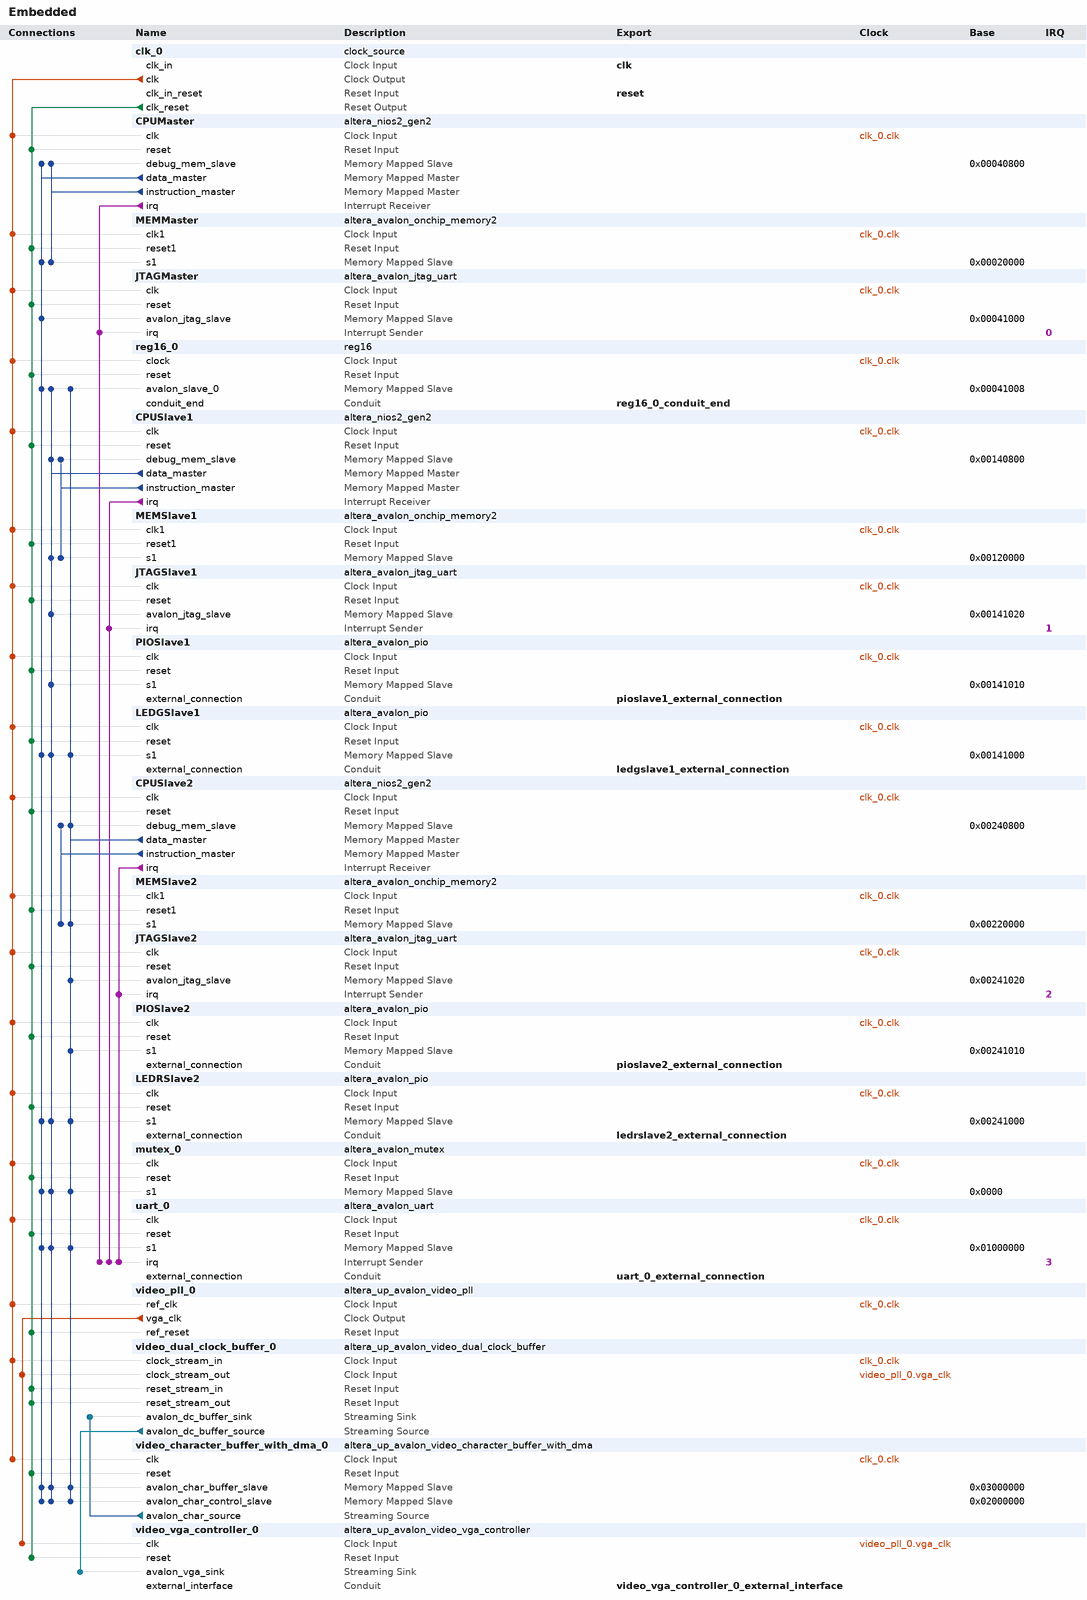
[diagram p0: system contents]
# Platform Designer (Qsys) system Embedded, Cyclone IV E EP4CE115F29C7
# Parameters at their usual value, and those the tool derives, are not listed.
package require -exact qsys 15.0
create_system Embedded
set_project_property DEVICE_FAMILY {Cyclone IV E}
set_project_property DEVICE EP4CE115F29C7

add_instance clk_0 clock_source 15.0
set_instance_parameter_value clk_0 clockFrequency 50000000

add_instance CPUMaster altera_nios2_gen2 15.0
set_instance_parameter_value CPUMaster dcache_size 2048
set_instance_parameter_value CPUMaster exceptionSlave MEMMaster.s1
set_instance_parameter_value CPUMaster icache_size 4096
set_instance_parameter_value CPUMaster impl Fast
set_instance_parameter_value CPUMaster resetSlave MEMMaster.s1

add_instance MEMMaster altera_avalon_onchip_memory2 15.0
set_instance_parameter_value MEMMaster dataWidth 32
set_instance_parameter_value MEMMaster dualPort false
set_instance_parameter_value MEMMaster initMemContent true
set_instance_parameter_value MEMMaster initializationFileName onchip_mem.hex
set_instance_parameter_value MEMMaster memorySize 100000

add_instance JTAGMaster altera_avalon_jtag_uart 15.0
set_instance_parameter_value JTAGMaster simInteractiveOptions NO_INTERACTIVE_WINDOWS

add_instance reg16_0 reg16 1.0

add_instance CPUSlave1 altera_nios2_gen2 15.0
set_instance_parameter_value CPUSlave1 dcache_size 2048
set_instance_parameter_value CPUSlave1 exceptionSlave MEMSlave1.s1
set_instance_parameter_value CPUSlave1 icache_size 4096
set_instance_parameter_value CPUSlave1 impl Fast
set_instance_parameter_value CPUSlave1 resetSlave MEMSlave1.s1

add_instance MEMSlave1 altera_avalon_onchip_memory2 15.0
set_instance_parameter_value MEMSlave1 dataWidth 32
set_instance_parameter_value MEMSlave1 dualPort false
set_instance_parameter_value MEMSlave1 initMemContent true
set_instance_parameter_value MEMSlave1 initializationFileName onchip_mem.hex
set_instance_parameter_value MEMSlave1 memorySize 80000

add_instance JTAGSlave1 altera_avalon_jtag_uart 15.0
set_instance_parameter_value JTAGSlave1 simInteractiveOptions NO_INTERACTIVE_WINDOWS

add_instance PIOSlave1 altera_avalon_pio 15.0
set_instance_parameter_value PIOSlave1 direction Input
set_instance_parameter_value PIOSlave1 width 16

add_instance LEDGSlave1 altera_avalon_pio 15.0
set_instance_parameter_value LEDGSlave1 direction Output
set_instance_parameter_value LEDGSlave1 width 8

add_instance CPUSlave2 altera_nios2_gen2 15.0
set_instance_parameter_value CPUSlave2 dcache_size 2048
set_instance_parameter_value CPUSlave2 exceptionSlave MEMSlave2.s1
set_instance_parameter_value CPUSlave2 icache_size 4096
set_instance_parameter_value CPUSlave2 impl Fast
set_instance_parameter_value CPUSlave2 resetSlave MEMSlave2.s1

add_instance MEMSlave2 altera_avalon_onchip_memory2 15.0
set_instance_parameter_value MEMSlave2 dataWidth 32
set_instance_parameter_value MEMSlave2 dualPort false
set_instance_parameter_value MEMSlave2 initMemContent true
set_instance_parameter_value MEMSlave2 initializationFileName onchip_mem.hex
set_instance_parameter_value MEMSlave2 memorySize 80000

add_instance JTAGSlave2 altera_avalon_jtag_uart 15.0
set_instance_parameter_value JTAGSlave2 simInteractiveOptions NO_INTERACTIVE_WINDOWS

add_instance PIOSlave2 altera_avalon_pio 15.0
set_instance_parameter_value PIOSlave2 direction Input
set_instance_parameter_value PIOSlave2 width 16

add_instance LEDRSlave2 altera_avalon_pio 15.0
set_instance_parameter_value LEDRSlave2 direction Output
set_instance_parameter_value LEDRSlave2 width 8

add_instance mutex_0 altera_avalon_mutex 15.0

add_instance uart_0 altera_avalon_uart 15.0
set_instance_parameter_value uart_0 baud 2400
set_instance_parameter_value uart_0 dataBits 8
set_instance_parameter_value uart_0 fixedBaud true
set_instance_parameter_value uart_0 parity NONE
set_instance_parameter_value uart_0 stopBits 1

add_instance video_pll_0 altera_up_avalon_video_pll 14.0
set_instance_parameter_value video_pll_0 camera {5MP Digital Camera}
set_instance_parameter_value video_pll_0 gui_refclk 50.0
set_instance_parameter_value video_pll_0 lcd {7" LCD on VEEK-MT and MTL Module}

add_instance video_dual_clock_buffer_0 altera_up_avalon_video_dual_clock_buffer 14.0
set_instance_parameter_value video_dual_clock_buffer_0 color_bits 10

add_instance video_character_buffer_with_dma_0 altera_up_avalon_video_character_buffer_with_dma 14.0
set_instance_parameter_value video_character_buffer_with_dma_0 enable_transparency false

add_instance video_vga_controller_0 altera_up_avalon_video_vga_controller 14.0
set_instance_parameter_value video_vga_controller_0 board DE2-115
set_instance_parameter_value video_vga_controller_0 resolution {VGA 640x480}

# connections
add_connection clk_0.clk CPUMaster.clk clock
add_connection clk_0.clk CPUSlave1.clk clock
add_connection clk_0.clk CPUSlave2.clk clock
add_connection clk_0.clk JTAGMaster.clk clock
add_connection clk_0.clk JTAGSlave1.clk clock
add_connection clk_0.clk JTAGSlave2.clk clock
add_connection clk_0.clk LEDGSlave1.clk clock
add_connection clk_0.clk LEDRSlave2.clk clock
add_connection clk_0.clk MEMMaster.clk1 clock
add_connection clk_0.clk MEMSlave1.clk1 clock
add_connection clk_0.clk MEMSlave2.clk1 clock
add_connection clk_0.clk mutex_0.clk clock
add_connection clk_0.clk PIOSlave1.clk clock
add_connection clk_0.clk PIOSlave2.clk clock
add_connection clk_0.clk reg16_0.clock clock
add_connection clk_0.clk uart_0.clk clock
add_connection clk_0.clk video_character_buffer_with_dma_0.clk clock
add_connection clk_0.clk video_dual_clock_buffer_0.clock_stream_in clock
add_connection clk_0.clk video_pll_0.ref_clk clock
add_connection video_pll_0.vga_clk video_dual_clock_buffer_0.clock_stream_out clock
add_connection video_pll_0.vga_clk video_vga_controller_0.clk clock
add_connection clk_0.clk_reset CPUMaster.reset reset
add_connection clk_0.clk_reset CPUSlave1.reset reset
add_connection clk_0.clk_reset CPUSlave2.reset reset
add_connection clk_0.clk_reset JTAGMaster.reset reset
add_connection clk_0.clk_reset JTAGSlave1.reset reset
add_connection clk_0.clk_reset JTAGSlave2.reset reset
add_connection clk_0.clk_reset LEDGSlave1.reset reset
add_connection clk_0.clk_reset LEDRSlave2.reset reset
add_connection clk_0.clk_reset MEMMaster.reset1 reset
add_connection clk_0.clk_reset MEMSlave1.reset1 reset
add_connection clk_0.clk_reset MEMSlave2.reset1 reset
add_connection clk_0.clk_reset mutex_0.reset reset
add_connection clk_0.clk_reset PIOSlave1.reset reset
add_connection clk_0.clk_reset PIOSlave2.reset reset
add_connection clk_0.clk_reset reg16_0.reset reset
add_connection clk_0.clk_reset uart_0.reset reset
add_connection clk_0.clk_reset video_character_buffer_with_dma_0.reset reset
add_connection clk_0.clk_reset video_dual_clock_buffer_0.reset_stream_in reset
add_connection clk_0.clk_reset video_dual_clock_buffer_0.reset_stream_out reset
add_connection clk_0.clk_reset video_pll_0.ref_reset reset
add_connection clk_0.clk_reset video_vga_controller_0.reset reset
add_connection CPUMaster.data_master CPUMaster.debug_mem_slave avalon
set_connection_parameter_value CPUMaster.data_master/CPUMaster.debug_mem_slave baseAddress 0x00040800
add_connection CPUMaster.data_master JTAGMaster.avalon_jtag_slave avalon
set_connection_parameter_value CPUMaster.data_master/JTAGMaster.avalon_jtag_slave baseAddress 0x00041000
add_connection CPUMaster.data_master LEDGSlave1.s1 avalon
set_connection_parameter_value CPUMaster.data_master/LEDGSlave1.s1 baseAddress 0x00141000
add_connection CPUMaster.data_master LEDRSlave2.s1 avalon
set_connection_parameter_value CPUMaster.data_master/LEDRSlave2.s1 baseAddress 0x00241000
add_connection CPUMaster.data_master MEMMaster.s1 avalon
set_connection_parameter_value CPUMaster.data_master/MEMMaster.s1 baseAddress 0x00020000
add_connection CPUMaster.data_master mutex_0.s1 avalon
set_connection_parameter_value CPUMaster.data_master/mutex_0.s1 baseAddress 0x0000
add_connection CPUMaster.data_master reg16_0.avalon_slave_0 avalon
set_connection_parameter_value CPUMaster.data_master/reg16_0.avalon_slave_0 baseAddress 0x00041008
add_connection CPUMaster.data_master uart_0.s1 avalon
set_connection_parameter_value CPUMaster.data_master/uart_0.s1 baseAddress 0x01000000
add_connection CPUMaster.data_master video_character_buffer_with_dma_0.avalon_char_buffer_slave avalon
set_connection_parameter_value CPUMaster.data_master/video_character_buffer_with_dma_0.avalon_char_buffer_slave baseAddress 0x03000000
add_connection CPUMaster.data_master video_character_buffer_with_dma_0.avalon_char_control_slave avalon
set_connection_parameter_value CPUMaster.data_master/video_character_buffer_with_dma_0.avalon_char_control_slave baseAddress 0x02000000
add_connection CPUMaster.instruction_master CPUMaster.debug_mem_slave avalon
set_connection_parameter_value CPUMaster.instruction_master/CPUMaster.debug_mem_slave baseAddress 0x00040800
add_connection CPUMaster.instruction_master MEMMaster.s1 avalon
set_connection_parameter_value CPUMaster.instruction_master/MEMMaster.s1 baseAddress 0x00020000
add_connection CPUSlave1.data_master CPUSlave1.debug_mem_slave avalon
set_connection_parameter_value CPUSlave1.data_master/CPUSlave1.debug_mem_slave baseAddress 0x00140800
add_connection CPUSlave1.data_master JTAGSlave1.avalon_jtag_slave avalon
set_connection_parameter_value CPUSlave1.data_master/JTAGSlave1.avalon_jtag_slave baseAddress 0x00141020
add_connection CPUSlave1.data_master LEDGSlave1.s1 avalon
set_connection_parameter_value CPUSlave1.data_master/LEDGSlave1.s1 baseAddress 0x00141000
add_connection CPUSlave1.data_master LEDRSlave2.s1 avalon
set_connection_parameter_value CPUSlave1.data_master/LEDRSlave2.s1 baseAddress 0x00241000
add_connection CPUSlave1.data_master MEMSlave1.s1 avalon
set_connection_parameter_value CPUSlave1.data_master/MEMSlave1.s1 baseAddress 0x00120000
add_connection CPUSlave1.data_master mutex_0.s1 avalon
set_connection_parameter_value CPUSlave1.data_master/mutex_0.s1 baseAddress 0x0000
add_connection CPUSlave1.data_master PIOSlave1.s1 avalon
set_connection_parameter_value CPUSlave1.data_master/PIOSlave1.s1 baseAddress 0x00141010
add_connection CPUSlave1.data_master reg16_0.avalon_slave_0 avalon
set_connection_parameter_value CPUSlave1.data_master/reg16_0.avalon_slave_0 baseAddress 0x00041008
add_connection CPUSlave1.data_master uart_0.s1 avalon
set_connection_parameter_value CPUSlave1.data_master/uart_0.s1 baseAddress 0x01000000
add_connection CPUSlave1.data_master video_character_buffer_with_dma_0.avalon_char_buffer_slave avalon
set_connection_parameter_value CPUSlave1.data_master/video_character_buffer_with_dma_0.avalon_char_buffer_slave baseAddress 0x03000000
add_connection CPUSlave1.data_master video_character_buffer_with_dma_0.avalon_char_control_slave avalon
set_connection_parameter_value CPUSlave1.data_master/video_character_buffer_with_dma_0.avalon_char_control_slave baseAddress 0x02000000
add_connection CPUSlave1.instruction_master CPUSlave1.debug_mem_slave avalon
set_connection_parameter_value CPUSlave1.instruction_master/CPUSlave1.debug_mem_slave baseAddress 0x00140800
add_connection CPUSlave1.instruction_master MEMSlave1.s1 avalon
set_connection_parameter_value CPUSlave1.instruction_master/MEMSlave1.s1 baseAddress 0x00120000
add_connection CPUSlave2.data_master CPUSlave2.debug_mem_slave avalon
set_connection_parameter_value CPUSlave2.data_master/CPUSlave2.debug_mem_slave baseAddress 0x00240800
add_connection CPUSlave2.data_master JTAGSlave2.avalon_jtag_slave avalon
set_connection_parameter_value CPUSlave2.data_master/JTAGSlave2.avalon_jtag_slave baseAddress 0x00241020
add_connection CPUSlave2.data_master LEDGSlave1.s1 avalon
set_connection_parameter_value CPUSlave2.data_master/LEDGSlave1.s1 baseAddress 0x00141000
add_connection CPUSlave2.data_master LEDRSlave2.s1 avalon
set_connection_parameter_value CPUSlave2.data_master/LEDRSlave2.s1 baseAddress 0x00241000
add_connection CPUSlave2.data_master MEMSlave2.s1 avalon
set_connection_parameter_value CPUSlave2.data_master/MEMSlave2.s1 baseAddress 0x00220000
add_connection CPUSlave2.data_master mutex_0.s1 avalon
set_connection_parameter_value CPUSlave2.data_master/mutex_0.s1 baseAddress 0x0000
add_connection CPUSlave2.data_master PIOSlave2.s1 avalon
set_connection_parameter_value CPUSlave2.data_master/PIOSlave2.s1 baseAddress 0x00241010
add_connection CPUSlave2.data_master reg16_0.avalon_slave_0 avalon
set_connection_parameter_value CPUSlave2.data_master/reg16_0.avalon_slave_0 baseAddress 0x00041008
add_connection CPUSlave2.data_master uart_0.s1 avalon
set_connection_parameter_value CPUSlave2.data_master/uart_0.s1 baseAddress 0x01000000
add_connection CPUSlave2.data_master video_character_buffer_with_dma_0.avalon_char_buffer_slave avalon
set_connection_parameter_value CPUSlave2.data_master/video_character_buffer_with_dma_0.avalon_char_buffer_slave baseAddress 0x03000000
add_connection CPUSlave2.data_master video_character_buffer_with_dma_0.avalon_char_control_slave avalon
set_connection_parameter_value CPUSlave2.data_master/video_character_buffer_with_dma_0.avalon_char_control_slave baseAddress 0x02000000
add_connection CPUSlave2.instruction_master CPUSlave2.debug_mem_slave avalon
set_connection_parameter_value CPUSlave2.instruction_master/CPUSlave2.debug_mem_slave baseAddress 0x00240800
add_connection CPUSlave2.instruction_master MEMSlave2.s1 avalon
set_connection_parameter_value CPUSlave2.instruction_master/MEMSlave2.s1 baseAddress 0x00220000
add_connection video_character_buffer_with_dma_0.avalon_char_source video_dual_clock_buffer_0.avalon_dc_buffer_sink avalon_streaming
add_connection video_dual_clock_buffer_0.avalon_dc_buffer_source video_vga_controller_0.avalon_vga_sink avalon_streaming
add_connection CPUMaster.irq JTAGMaster.irq interrupt
set_connection_parameter_value CPUMaster.irq/JTAGMaster.irq irqNumber 0
add_connection CPUMaster.irq uart_0.irq interrupt
set_connection_parameter_value CPUMaster.irq/uart_0.irq irqNumber 3
add_connection CPUSlave1.irq JTAGSlave1.irq interrupt
set_connection_parameter_value CPUSlave1.irq/JTAGSlave1.irq irqNumber 1
add_connection CPUSlave1.irq uart_0.irq interrupt
set_connection_parameter_value CPUSlave1.irq/uart_0.irq irqNumber 4
add_connection CPUSlave2.irq JTAGSlave2.irq interrupt
set_connection_parameter_value CPUSlave2.irq/JTAGSlave2.irq irqNumber 2
add_connection CPUSlave2.irq uart_0.irq interrupt
set_connection_parameter_value CPUSlave2.irq/uart_0.irq irqNumber 5

# exported interfaces
add_interface clk clock sink
set_interface_property clk EXPORT_OF clk_0.clk_in
add_interface ledgslave1_external_connection conduit end
set_interface_property ledgslave1_external_connection EXPORT_OF LEDGSlave1.external_connection
add_interface ledrslave2_external_connection conduit end
set_interface_property ledrslave2_external_connection EXPORT_OF LEDRSlave2.external_connection
add_interface pioslave1_external_connection conduit end
set_interface_property pioslave1_external_connection EXPORT_OF PIOSlave1.external_connection
add_interface pioslave2_external_connection conduit end
set_interface_property pioslave2_external_connection EXPORT_OF PIOSlave2.external_connection
add_interface reg16_0_conduit_end conduit end
set_interface_property reg16_0_conduit_end EXPORT_OF reg16_0.conduit_end
add_interface reset reset sink
set_interface_property reset EXPORT_OF clk_0.clk_in_reset
add_interface uart_0_external_connection conduit end
set_interface_property uart_0_external_connection EXPORT_OF uart_0.external_connection
add_interface video_vga_controller_0_external_interface conduit end
set_interface_property video_vga_controller_0_external_interface EXPORT_OF video_vga_controller_0.external_interface

set_interconnect_requirement {$system} qsys_mm.clockCrossingAdapter HANDSHAKE
set_interconnect_requirement {$system} qsys_mm.enableEccProtection FALSE
set_interconnect_requirement {$system} qsys_mm.insertDefaultSlave FALSE
set_interconnect_requirement {$system} qsys_mm.maxAdditionalLatency 1

save_system Embedded.qsys
